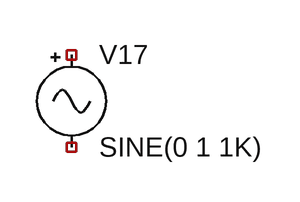
[diagram p0: schematic 06- Other components explicit Defaults.asc]
06- Other components explicit Defaults.asc, the LTspice schematic file:
Version 4.1
SHEET 1 1396 2016
SYMBOL Misc\\signal 96 1856 R0
SYMATTR InstName V17

The netlist it stands for:
* 06- Other components explicit Defaults.asc
V17 NC_01 NC_02 SINE(0 1 1K)
.backanno
.end